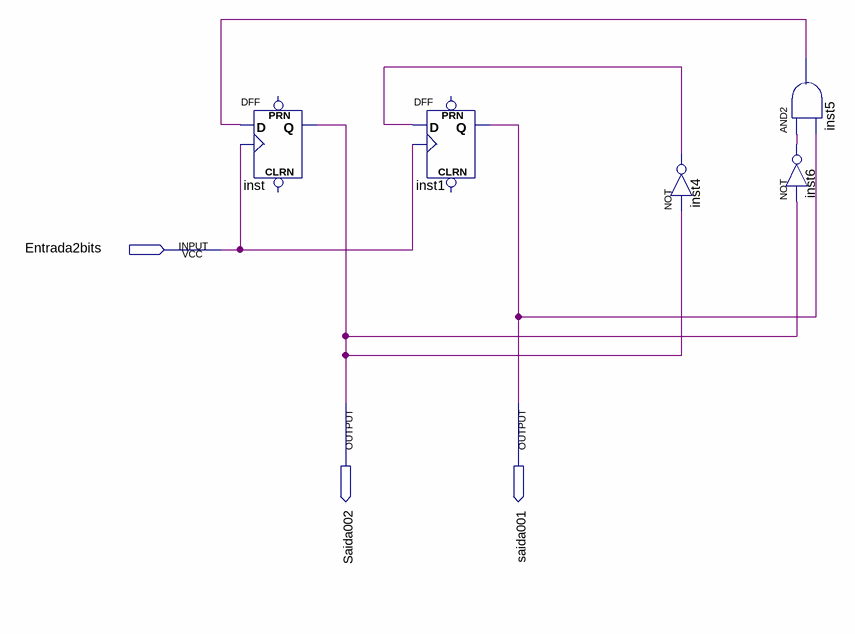
[diagram p0: schematic sheet]
// Quartus schematic Seletorde2bits.bdf as structural Verilog: 5 symbols, 3 pins
module Seletorde2bits (
  input  Entrada2bits,
  output Saida002,
  output saida001
);

  wire inst4_out, inst5_out, inst6_out;

  DFF inst (.CLK(Entrada2bits), .D(inst5_out), .Q(Saida002));  // open: CLRN, PRN
  DFF inst1 (.CLK(Entrada2bits), .D(inst4_out), .Q(saida001));  // open: CLRN, PRN
  not inst4 (inst4_out, Saida002);
  and inst5 (inst5_out, inst6_out, saida001);
  not inst6 (inst6_out, Saida002);
endmodule
